# Altium project Compact Inverter H7 Logic Ver B.PrjPcb (part 2 of 2)

## Sheet MotorConnector.SchDoc
size A; SheetNumber: 8; SheetTotal: 11
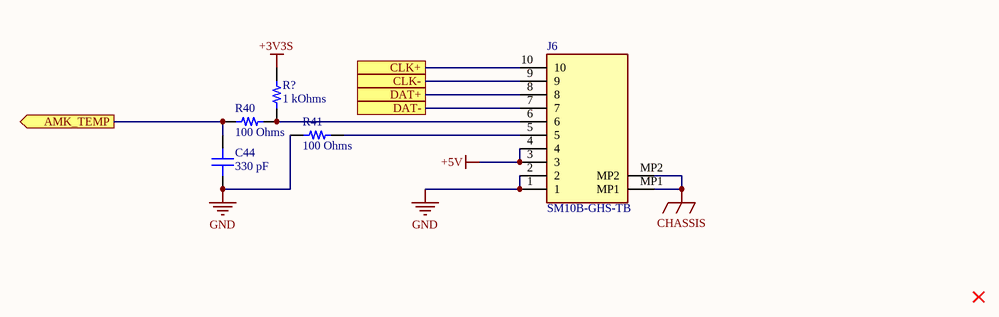
[diagram p6: MotorConnector.SchDoc]

### Parts
C44  330 pF  [CAP 0402_1005]
J6  SM10B-GHS-TB  [SM10BGHSTB]
R40  100 Ohms  [RES 0402_1005]
R41  100 Ohms  [RES 0402_1005]
R?  1 kOhms  [RES 0402_1005]

### Ports
AMK_TEMP (out), CLK+, CLK-, DAT+, DAT-

### Nets
+3V3S: R?.2  [project net 3V]
+5V: J6.3 J6.4
CHASSIS: J6.MP1 J6.MP2
GND: C44.1 J6.1 J6.2 R41.1
TEMP4: C44.2 R40.1 ; port AMK_TEMP
NetC1_2: J6.8 ; port DAT+
NetC3_1: J6.7 ; port DAT-
NetC4_2: J6.10 ; port CLK+
NetC6_1: J6.9 ; port CLK-
NetJ6_5: J6.5 R41.2
NetJ6_6: J6.6 R40.2 R?.1

### Library data of the parts
C44 = HMK105B7331MV-F: CAP CER 330PF 100V X7R 0402; manufacturer: Taiyo Yuden; Tolerance: ±20%; Part Number: HMK105B7331MV-F; Capacitance: 330 pF; Applications: SMPS Filtering; componentlink1description: Datasheet; componentlink1url: http://www.yuden.co.jp/productdata/catalog/mlcc06_e.pdf; componentlink2description: DigiKey Link; componentlink2url: https://www.digikey.com/en/products/detail/taiyo-yuden/HMK105B7331MV-F/6563581; Device Package: 0402 (1005 Metric); lastupdated: 2/9/2024 8:04:38 PM; Lifecycle Status: Active; Minimum Order: 1; Mounting Type: Surface Mount, MLCC; Operating Temperature: -55°C ~ 125°C; Package / Case: 0402 (1005 Metric); packaging: TapeAndReel; partid: 1855; Part Status: Active; price: 0.03; series: M; Size / Dimension: 0.039" L x 0.020" W (1.00mm x 0.50mm); Supplier 1: DigiKey; Supplier Part Number 1: 587-4988-1-ND; Temperature Coefficient: X7R; Thickness (Max): 0.022" (0.55mm); value: 330 pF; Voltage - Rated: 100V
J6 = SM10B-GHS-TB: Connector; Manufacturer_Name: 3D SYSTEMS; Datasheet Link: https://4donline.ihs.com/images/VipMasterIC/IC/JSTM/JSTMS02184/JSTMS02184-1.pdf?hkey=EF798316E3902B6ED9A73243A3159BB0; Height: 4.25mm; Manufacturer_Part_Number: SM10B-GHS-TB
R40 R41 = WR04X1000FTL: RES 100 OHM 1% 1/16W 0402; Manufacturer: Walsin Technology Corporation; Power (Watts): 0.063W, 1/16W; Temperature Coefficient: ±100ppm/°C; Part Number: WR04X1000FTL; Value: 100 Ohms; ComponentLink1Description: Datasheet; ComponentLink1URL: https://www.passivecomponent.com/wp-content/uploads/chipR/ASC_WR.pdf; ComponentLink2Description: DigiKey Link; ComponentLink2URL: https://www.digikey.com/en/products/detail/walsin-technology-corporation/WR04X1000FTL/13241075; Composition: Thick Film; Device Package: 0402 (1005 Metric); Height - Seated (Max): 0.016" (0.40mm); LastUpdated: 2/9/2024 8:28:55 PM; Lifecycle Status: Active; Minimum Order: 1; Number of Terminations: 2; Operating Temperature: -55°C ~ 155°C; Package / Case: 0402 (1005 Metric); Packaging: CutTape; PartId: 64787; Part Status: Active; Price: 0.01; Resistance: 100 Ohms; Series: WR; Size / Dimension: 0.039" L x 0.020" W (1.00mm x 0.50mm); Supplier 1: DigiKey; Supplier Part Number 1: 1292-WR04X1000FTLCT-ND; Supplier Device Package: 0402; Tolerance: ±1%
R? = WR04X1000FTL: RES 100 OHM 1% 1/16W 0402; Manufacturer: Walsin Technology Corporation; Power (Watts): 0.063W, 1/16W; Resistance: 100 Ohms; Temperature Coefficient: ±100ppm/°C; Part Number: WR04X1000FTL; Value: 1 kOhms; ComponentLink1Description: Datasheet; ComponentLink1URL: https://www.passivecomponent.com/wp-content/uploads/chipR/ASC_WR.pdf; ComponentLink2Description: DigiKey Link; ComponentLink2URL: https://www.digikey.com/en/products/detail/walsin-technology-corporation/WR04X1000FTL/13241075; Composition: Thick Film; Device Package: 0402 (1005 Metric); Height - Seated (Max): 0.016" (0.40mm); LastUpdated: 2/9/2024 8:28:55 PM; Lifecycle Status: Active; Minimum Order: 1; Number of Terminations: 2; Operating Temperature: -55°C ~ 155°C; Package / Case: 0402 (1005 Metric); Packaging: CutTape; PartId: 64787; Part Status: Active; Price: 0.01; Series: WR; Size / Dimension: 0.039" L x 0.020" W (1.00mm x 0.50mm); Supplier 1: DigiKey; Supplier Part Number 1: 1292-WR04X1000FTLCT-ND; Supplier Device Package: 0402; Tolerance: ±1%

## Sheet CANConnector.SchDoc
size A; SheetNumber: 9; SheetTotal: 11
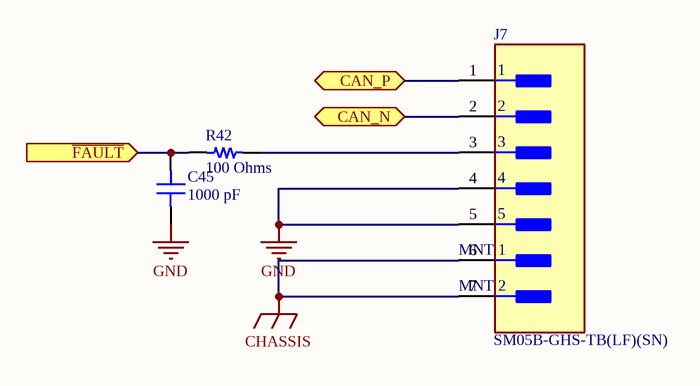
[diagram p7: CANConnector.SchDoc]

### Parts
C45  1000 pF  [CAP 0402_1005]
J7  SM05B-GHS-TB(LF)(SN)  [FP-SM05B-GHS-TB_LF_SN-MFG]
R42  100 Ohms  [RES 0402_1005]

### Ports
CAN_N (bidir), CAN_P (bidir), ~{FAULT} (in)

### Nets
CHASSIS: J7.6(MNT_1) J7.7(MNT_2)
GND: C45.1 J7.4 J7.5
CAN_N: J7.2 ; port CAN_N
CAN_P: J7.1 ; port CAN_P
~{FAULT}: C45.2 R42.1 ; port ~{FAULT}
NetJ7_3: J7.3 R42.2

### Library data of the parts
C45 = UMK105CG102JVHF: CAP CER 1000PF 50V C0G/NP0 0402; manufacturer: Taiyo Yuden; Temperature Coefficient: C0G, NP0; Tolerance: ±5%; Part Number: UMK105CG102JVHF; Capacitance: 1000 pF; Applications: Automotive; componentlink1description: Datasheet; componentlink1url: https://ds.yuden.co.jp/TYCOMPAS/ut/detail?pn=UMK105CG102JVHF &u=M; componentlink2description: DigiKey Link; componentlink2url: https://www.digikey.com/en/products/detail/taiyo-yuden/UMK105CG102JVHF/4811103; Device Package: 0402 (1005 Metric); lastupdated: 2/9/2024 8:04:38 PM; Lifecycle Status: Active; Minimum Order: 1; Mounting Type: Surface Mount, MLCC; Operating Temperature: -55°C ~ 125°C; Package / Case: 0402 (1005 Metric); packaging: TapeAndReel; partid: 1779; Part Status: Active; price: 0.01; Ratings: AEC-Q200; series: M; Size / Dimension: 0.039" L x 0.020" W (1.00mm x 0.50mm); Supplier 1: DigiKey; Supplier Part Number 1: 587-3737-1-ND; Thickness (Max): 0.022" (0.55mm); value: 1000 pF; Voltage - Rated: 50V
J7 = CMP-17439-000048-1: CONN HEADER SMD R/A 5POS 1.25MM; Current Rating: 1A; Pitch: 0.049inch; Connector Type: Outer Shroud Contact; Number of Positions: 5; Voltage Rating (AC): 50V; Wire/Cable Gauge: 26AWG; Series: GH; Mount: Surface Mount; Housing Material: Nylon; Contact Type: Outer Shroud Contact; REACH SVHC: No SVHC; Number of Rows: 1; Lead Free: Lead Free; Color: Natural; Contact Material: Bronze; Contact Plating: Tin; Max Operating Temperature: 85°C; Orientation: Right Angle; Number of Contacts: 5; Voltage Rating: 50V; Housing Color: Natural; Termination: Solder; Min Operating Temperature: -25°C; Fastening Type: Ramp; Packaging: Tape and Reel
R42 = WR04X1000FTL: as R40 on sheet MotorConnector; Part Number: WR04X1000FTL; Value: 100 Ohms; ComponentLink1Description: Datasheet; ComponentLink1URL: https://www.passivecomponent.com/wp-content/uploads/chipR/ASC_WR.pdf; ComponentLink2Description: DigiKey Link; ComponentLink2URL: https://www.digikey.com/en/products/detail/walsin-technology-corporation/WR04X1000FTL/13241075; Composition: Thick Film; Device Package: 0402 (1005 Metric); Height - Seated (Max): 0.016" (0.40mm); LastUpdated: 2/9/2024 8:28:55 PM; Lifecycle Status: Active; Minimum Order: 1; Number of Terminations: 2; Operating Temperature: -55°C ~ 155°C; Package / Case: 0402 (1005 Metric); Packaging: CutTape; PartId: 64787; Part Status: Active; Price: 0.01; Resistance: 100 Ohms; Series: WR; Size / Dimension: 0.039" L x 0.020" W (1.00mm x 0.50mm); Supplier 1: DigiKey; Supplier Part Number 1: 1292-WR04X1000FTLCT-ND; Supplier Device Package: 0402; Tolerance: ±1%

## Sheet Power.SchDoc
size A; SheetNumber: 3; SheetTotal: 11
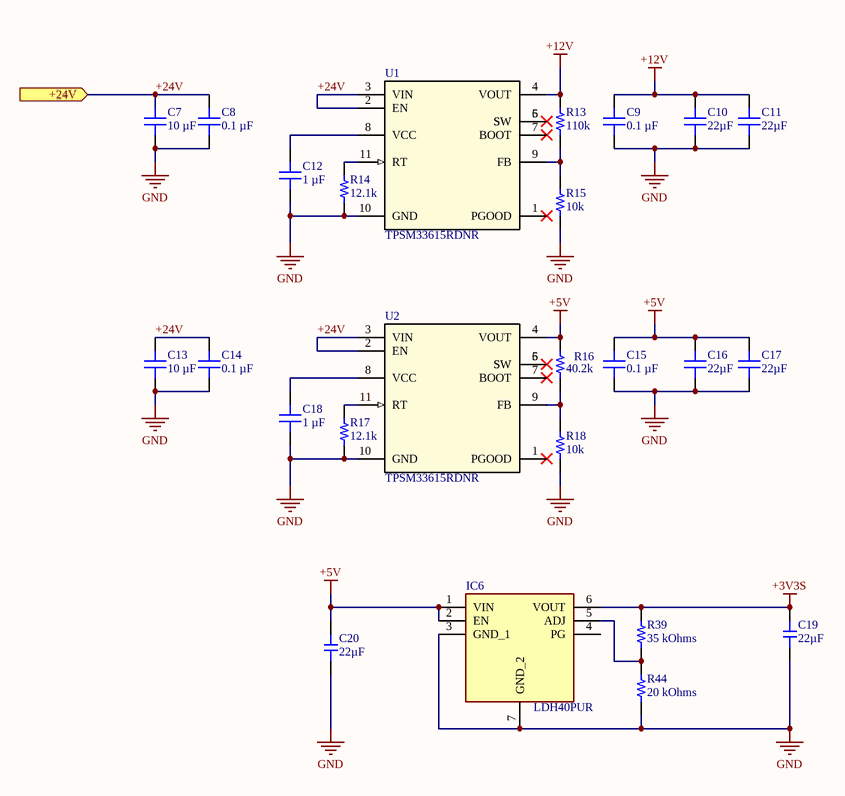
[diagram p8: Power.SchDoc]

### Parts
C7  10 µF  [CAP 1210_3225 - 1MM]
C8  0.1 µF  [CAP 0402_1005]
C9  0.1 µF  [CAP 0402_1005]
C10  22µF  [CAP 1210_3225 - 2.8MM]
C11  22µF  [CAP 1210_3225 - 2.8MM]
C12  1 µF  [CAP 0402_1005]
C13  10 µF  [CAP 1210_3225 - 1MM]
C14  0.1 µF  [CAP 0402_1005]
C15  0.1 µF  [CAP 0402_1005]
C16  22µF  [CAP 1210_3225 - 2.8MM]
C17  22µF  [CAP 1210_3225 - 2.8MM]
C18  1 µF  [CAP 0402_1005]
C19  value 22µF  [CAP-0603]  (hidden comment: CL10A226MQ8NRNC)
C20  value 22µF  [CAP-0603]  (hidden comment: CL10A226MQ8NRNC)
IC6  LDH40PUR  [SON65P200X200X80-7N]
R13  110k  [RES 0402_1005]
R14  12.1k  [RES 0402_1005]
R15  10k  [RES 0402_1005]
R16  40.2k  [RES 0402_1005]
R17  12.1k  [RES 0402_1005]
R18  10k  [RES 0402_1005]
R39  35 kOhms  [RES 0402_1005]
R44  20 kOhms  [RES 0402_1005]
U1  TPSM33615RDNR  [RDN0011A-MFG]
U2  TPSM33615RDNR  [RDN0011A-MFG]

### Ports
+24V (in)

### Nets
+3V3S: C19.2 IC6.6(VOUT) R39.1  [project net 3V]
+5V: C15.2 C16.2 C17.2 C20.2 IC6.1(VIN) IC6.2(EN) R16.1 U2.4(VOUT)
+12V: C9.2 C10.2 C11.2 R13.1 U1.4(VOUT)  [project net 12V]
GND: C7.1 C8.1 C9.1 C10.1 C11.1 C12.1 C13.1 C14.1 C15.1 C16.1 C17.1 C18.1 C19.1 C20.1 IC6.3(GND_1) IC6.7(GND_2) R14.2 R15.2 R17.2 R18.2 R44.2 U1.10(GND) U2.10(GND)
+24V: C7.2 C8.2 C13.2 C14.2 U1.2(EN) U1.3(VIN) U2.2(EN) U2.3(VIN) ; port +24V
NetC12_2: C12.2 U1.8(VCC)
NetC18_2: C18.2 U2.8(VCC)
NetIC6_5: IC6.5(ADJ) R39.2 R44.1
NetR13_2: R13.2 R15.1 U1.9(FB)
NetR14_1: R14.1 U1.11(RT)
NetR16_2: R16.2 R18.1 U2.9(FB)
NetR17_1: R17.1 U2.11(RT)
NetU1_5: U1.5(SW) U1.6(SW)
NetU2_5: U2.5(SW) U2.6(SW)

Not connected (* = marked no-connect by the designer): IC6 4(PG); U1 1(PGOOD)* 7(BOOT)*; U2 1(PGOOD)* 7(BOOT)*

### Library data of the parts
C7 C13 = GCJ32EC71H106KA01L: CAP CER 10UF 50V X7S 1210; manufacturer: Murata Electronics; Tolerance: ±10%; Part Number: GCJ32EC71H106KA01L; Value: 10 µF; Applications: Automotive, Boardflex Sensitive; Capacitance: 10 µF; componentlink1description: Datasheet; componentlink1url: https://search.murata.co.jp/Ceramy/image/img/A01X/G101/ENG/GCJ32EC71H106KA01-01.pdf; componentlink2description: DigiKey Link; componentlink2url: https://www.digikey.com/en/products/detail/murata-electronics/GCJ32EC71H106KA01L/6606047; Device Package: 1210 (3225 Metric); Features: Soft Termination; lastupdated: 6/4/2024 7:21:07 PM; Lifecycle Status: Active; Minimum Order: 1; Mounting Type: Surface Mount, MLCC; Operating Temperature: -55°C ~ 125°C; Package / Case: 1210 (3225 Metric); packaging: TapeAndReel; partid: 23622; Part Status: Active; price: 0.32; Ratings: AEC-Q200; series: GCJ; Size / Dimension: 0.126" L x 0.098" W (3.20mm x 2.50mm); Supplier 1: DigiKey; Supplier Part Number 1: 490-14418-1-ND; Temperature Coefficient: X7S; Thickness (Max): 0.110" (2.80mm); Voltage - Rated: 50V
C8 C9 C14 C15 = C0402C104K4RECAUTO: CAP CER 0402 0.1UF 16V X7R 10%; manufacturer: KEMET; Part Number: C0402C104K4RECAUTO; Capacitance: 0.1 µF; Applications: Automotive, ESD Protection; componentlink1description: Datasheet; componentlink1url: https://api.kemet.com/component-edge/download/datasheet/C0402C104K4RECAUTO.pdf; componentlink2description: DigiKey Link; componentlink2url: https://www.digikey.com/en/products/detail/kemet/C0402C104K4RECAUTO/8563695; Device Package: 0402 (1005 Metric); lastupdated: 2/9/2024 8:04:38 PM; Lifecycle Status: Active; Minimum Order: 1; Mounting Type: Surface Mount, MLCC; Operating Temperature: -55°C ~ 125°C; Package / Case: 0402 (1005 Metric); packaging: TapeAndReel; partid: 1731; Part Status: Active; price: 0.01; Ratings: AEC-Q200; series: ESD SMD Auto X7R; Size / Dimension: 0.039" L x 0.020" W (1.00mm x 0.50mm); Supplier 1: DigiKey; Supplier Part Number 1: 399-17167-1-ND; Temperature Coefficient: X7R; Thickness (Max): 0.022" (0.55mm); Tolerance: ±10%; value: 0.1 µF; Voltage - Rated: 16V
C10 C11 C16 C17 = 12103D226MAT2A: CAP CER 22UF 25V X5R 1210; manufacturer: AVX Corporation; Tolerance: ±20%; Part Number: 12103D226MAT2A; Value: 22µF; Applications: General Purpose; Capacitance: 22µF; componentlink1description: Datasheet; componentlink1url: http://datasheets.avx.com/cx5r.pdf; componentlink2description: DigiKey Link; componentlink2url: http://digikey.com/product-detail/en/avx-corporation/12103D226MAT2A/478-5045-1-ND/1888256; Device Package: 1210 (3225 Metric); lastupdated: 9/2/2020 1:10:51 AM; Lifecycle Status: Active; Minimum Order: 1; Mounting Type: Surface Mount, MLCC; Operating Temperature: -55°C ~ 85°C; Package / Case: 1210 (3225 Metric); packaging: TapeAndReel; partid: 23827; Part Status: Active; price: 0.32; series: -; Size / Dimension: 0.126" L x 0.098" W (3.20mm x 2.50mm); Supplier 1: DigiKey; Supplier Part Number 1: 478-5045-1-ND; Temperature Coefficient: X5R; Thickness (Max): 0.110" (2.79mm); Voltage - Rated: 25V
C12 C18 = CL05A105KO5NNNC: CAP CER 1UF 16V X5R 0402; Part Number: C29266; manufacturer: Samsung Electro-Mechanics; Tolerance: ±10%; Capacitance: 1 µF; Applications: General Purpose; componentlink1description: Datasheet; componentlink1url: http://www.samsungsem.com/kr/support/product-search/mlcc/CL05A105KO5NNNC.jsp; componentlink2description: DigiKey Link; componentlink2url: https://www.digikey.com/en/products/detail/samsung-electro-mechanics/CL05A105KO5NNNC/3886725; Device Package: 0402 (1005 Metric); lastupdated: 2/9/2024 8:04:35 PM; Lifecycle Status: Active; Minimum Order: 1; Mounting Type: Surface Mount, MLCC; Operating Temperature: -55°C ~ 85°C; Package / Case: 0402 (1005 Metric); packaging: TapeAndReel; partid: 3120; Part Status: Active; price: 0.01; series: CL; Size / Dimension: 0.039" L x 0.020" W (1.00mm x 0.50mm); Supplier 1: DigiKey; Supplier Part Number 1: 1276-1067-1-ND; Temperature Coefficient: X5R; Thickness (Max): 0.022" (0.55mm); value: 1 µF; Voltage - Rated: 16V
C19 C20 = CMP-001-00651-2: Capacitor, Ceramic (MLCC), 22uF, ±20%, 6.3V, X5R, ±20%, SMD 0603; Manufacturer: Samsung Electro-Mechanics; Impedance (0V Bias) @ 10kHz: 1.09Ω; Capacitance @ 1V DC Bias: 17.820uF; Capacitance @ 3.3V DC Bias: 8.834uF; Impedance (0V Bias) @ 500MHz: 0.428Ω; Impedance (0V Bias) @ 1kHz: 10.5Ω; Impedance (0V Bias) @ 500kHz: 0.0212Ω; Capacitance @ 1.8V DC Bias: 14.074uF; Impedance (0V Bias) @ 1MHz: 0.00751Ω; Impedance (0V Bias) @ 5kHz: 2.16Ω; Capacitance @ 1.5V DC Bias: 15.472uF; Impedance (0V Bias) @ 100MHz: 0.12Ω; Impedance (0V Bias) @ 100Hz: 100Ω; Impedance (0V Bias) @ 50kHz: 0.224Ω; Impedance (0V Bias) @ 5MHz: 0.0137Ω; Capacitance @ 5V DC Bias: 5.741uF; Impedance (0V Bias) @ 500Hz: 20.7Ω; Impedance (0V Bias) @ 5GHz: 3.43Ω; Capacitance @ 1.35V DC Bias: 16.197uF; Impedance (0V Bias) @ 10MHz: 0.0217Ω; Impedance (0V Bias) @ 2GHz: 1.72Ω; Capacitance @ 2.5V DC Bias: 11.369uF; Impedance (0V Bias) @ 50MHz: 0.0716Ω; Capacitance @ 1.2V DC Bias: 16.916uF; Impedance (0V Bias) @ 100kHz: 0.113Ω; Capacitance @ 4.2V DC Bias: 6.952uF; Capacitance @ 3.7V DC Bias: 7.897uF; Impedance (0V Bias) @ 1GHz: 0.751Ω; Temperature Rating: -55°C ~ 85°C; JLCPCB Basic Part: Yes; Temperature Coefficient: X5R; Tolerance: 20%; ComponentLink2Description: JLCPCB Part URL; ComponentLink1URL: https://wmsc.lcsc.com/wmsc/upload/file/pdf/v2/lcsc/2304140030_Samsung-Electro-Mechanics-CL10A226MQ8NRNC_C59461.pdf; ComponentLink4Description: Samsung Component Library; RoHS: Yes; Voltage Rating: 6.3V; ComponentLink4URL: https://weblib.samsungsem.com/mlcc/mlcc-ec.do?partNumber=CL10A226MQ8NRN; ComponentLink3Description: LCSC Part URL; ComponentLink2URL: https://jlcpcb.com/partdetail/C59461; Case/Package: 0603; Manufacturer Part Number: CL10A226MQ8NRNC; ComponentLink1Description: Datasheet; JLCPCB Part Number: C59461; ComponentLink3URL: https://lcsc.com/product-detail/Multilayer-Ceramic-Capacitors-MLCC---SMD-SMT_Samsung-Electro-Mechanics-Samsung-Electro-Mechanics-CL10A226MQ8NRNC_C59461.html; Design Item ID: CL10A226MQ8NRNC; Category: Capacitors - MLCC; Source: jlcpcb_2025_04_capacitors_basic.schlib
IC6 = LDH40PUR: Integrated Circuit; Manufacturer_Name: STMicroelectronics; Datasheet Link: https://www.st.com/resource/en/datasheet/ldh40.pdf; Height: 0.8mm; Manufacturer_Part_Number: LDH40PUR
R13 R16 = RQ73C1E10K5BTD: RES 10.5 KOHMS 0.1% 1/16W 0402; Part Number: C166559; Manufacturer: TE Connectivity Passive Product; Power (Watts): 0.063W, 1/16W; Resistance: 50k; Temperature Coefficient: ±10ppm/°C; ComponentLink1Description: Datasheet; ComponentLink1URL: //media.digikey.com/pdf/Data%20Sheets/Tyco%20Electronics%20P%20B%20PDFs/RQ73-0618%20v2.pdf; ComponentLink2Description: DigiKey Link; ComponentLink2URL: https://www.digikey.com/en/products/detail/te-connectivity-passive-product/RQ73C1E10K5BTD/9479898; Composition: Thin Film; Device Package: 0402 (1005 Metric); Features: Anti-Sulfur, Automotive AEC-Q200; Height - Seated (Max): 0.016" (0.40mm); LastUpdated: 2/9/2024 8:30:17 PM; Lifecycle Status: Active; Minimum Order: 1; Number of Terminations: 2; Operating Temperature: -55°C ~ 155°C; Package / Case: 0402 (1005 Metric); Packaging: TapeAndReel; PartId: 4287; Part Status: Active; Price: 0.27; Ratings: AEC-Q200; Series: RQ73; Size / Dimension: 0.039" L x 0.020" W (1.00mm x 0.50mm); Supplier 1: DigiKey; Supplier Part Number 1: A139950CT-ND; Supplier Device Package: 0402; Tolerance: ±0.1%
  R13: Value: 110k
  R16: Value: 40.2k
R14 R17 = RQ73C1E10K5BTD: RES 10.5 KOHMS 0.1% 1/16W 0402; Part Number: C132157; Manufacturer: TE Connectivity Passive Product; Power (Watts): 0.063W, 1/16W; Temperature Coefficient: ±10ppm/°C; Value: 12.1k; ComponentLink1Description: Datasheet; ComponentLink1URL: //media.digikey.com/pdf/Data%20Sheets/Tyco%20Electronics%20P%20B%20PDFs/RQ73-0618%20v2.pdf; ComponentLink2Description: DigiKey Link; ComponentLink2URL: https://www.digikey.com/en/products/detail/te-connectivity-passive-product/RQ73C1E10K5BTD/9479898; Composition: Thin Film; Device Package: 0402 (1005 Metric); Features: Anti-Sulfur, Automotive AEC-Q200; Height - Seated (Max): 0.016" (0.40mm); LastUpdated: 2/9/2024 8:30:17 PM; Lifecycle Status: Active; Minimum Order: 1; Number of Terminations: 2; Operating Temperature: -55°C ~ 155°C; Package / Case: 0402 (1005 Metric); Packaging: TapeAndReel; PartId: 4287; Part Status: Active; Price: 0.27; Ratings: AEC-Q200; Resistance: 12.1k; Series: RQ73; Size / Dimension: 0.039" L x 0.020" W (1.00mm x 0.50mm); Supplier 1: DigiKey; Supplier Part Number 1: A139950CT-ND; Supplier Device Package: 0402; Tolerance: ±0.1%
R15 R18 = RQ73C1E10K5BTD: RES 10.5 KOHMS 0.1% 1/16W 0402; Part Number: C25744; Manufacturer: TE Connectivity Passive Product; Power (Watts): 0.063W, 1/16W; Temperature Coefficient: ±10ppm/°C; Value: 10k; ComponentLink1Description: Datasheet; ComponentLink1URL: //media.digikey.com/pdf/Data%20Sheets/Tyco%20Electronics%20P%20B%20PDFs/RQ73-0618%20v2.pdf; ComponentLink2Description: DigiKey Link; ComponentLink2URL: https://www.digikey.com/en/products/detail/te-connectivity-passive-product/RQ73C1E10K5BTD/9479898; Composition: Thin Film; Device Package: 0402 (1005 Metric); Features: Anti-Sulfur, Automotive AEC-Q200; Height - Seated (Max): 0.016" (0.40mm); LastUpdated: 2/9/2024 8:30:17 PM; Lifecycle Status: Active; Minimum Order: 1; Number of Terminations: 2; Operating Temperature: -55°C ~ 155°C; Package / Case: 0402 (1005 Metric); Packaging: TapeAndReel; PartId: 4287; Part Status: Active; Price: 0.27; Ratings: AEC-Q200; Resistance: 10k; Series: RQ73; Size / Dimension: 0.039" L x 0.020" W (1.00mm x 0.50mm); Supplier 1: DigiKey; Supplier Part Number 1: A139950CT-ND; Supplier Device Package: 0402; Tolerance: ±0.1%
R39 R44 = WR04X102 JTL: RES 1K OHM 5% 1/16W 0402; Manufacturer: Walsin Technology Corporation; Power (Watts): 0.063W, 1/16W; Resistance: 1 kOhms; Temperature Coefficient: ±100ppm/°C; Part Number: WR04X102 JTL; ComponentLink1Description: Datasheet; ComponentLink1URL: https://www.passivecomponent.com/wp-content/uploads/chipR/ASC_WR.pdf; ComponentLink2Description: DigiKey Link; ComponentLink2URL: https://www.digikey.com/en/products/detail/walsin-technology-corporation/WR04X102-JTL/13238927; Composition: Thick Film; Device Package: 0402 (1005 Metric); Height - Seated (Max): 0.016" (0.40mm); LastUpdated: 2/9/2024 8:28:50 PM; Lifecycle Status: Active; Minimum Order: 1; Number of Terminations: 2; Operating Temperature: -55°C ~ 155°C; Package / Case: 0402 (1005 Metric); Packaging: CutTape; PartId: 68140; Part Status: Active; Price: 0.01; Series: WR; Size / Dimension: 0.039" L x 0.020" W (1.00mm x 0.50mm); Supplier 1: DigiKey; Supplier Part Number 1: 1292-WR04X102JTLCT-ND; Supplier Device Package: 0402; Tolerance: ±5%
  R39: Value: 35 kOhms
  R44: Value: 20 kOhms
U1 U2 = TPSM33615RDNR: No Description Available; Mfr_Name: Texas Instruments; TYPE: TYPE; RefDes: RefDes

## Sheet PowerConnector.SchDoc
size A; SheetNumber: 11; SheetTotal: 11
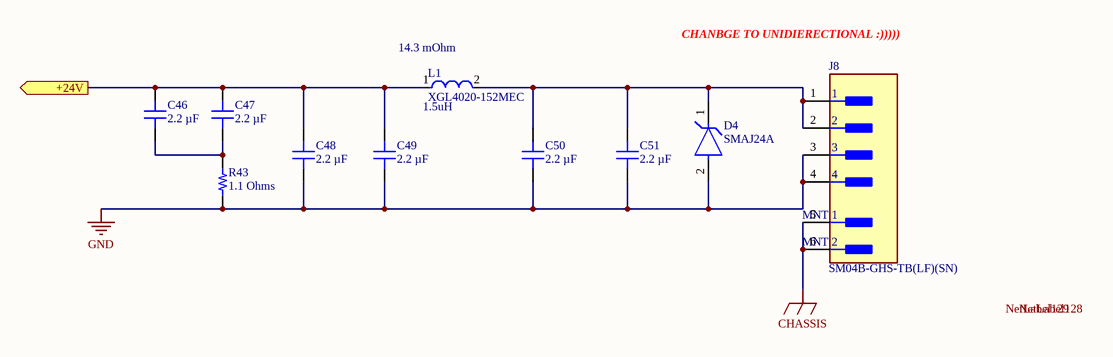
[diagram p9: PowerConnector.SchDoc]

### Parts
C46  2.2 µF  [CAP 0805_2012]
C47  2.2 µF  [CAP 0805_2012]
C48  2.2 µF  [CAP 0805_2012]
C49  2.2 µF  [CAP 0805_2012]
C50  2.2 µF  [CAP 0805_2012]
C51  2.2 µF  [CAP 0805_2012]
D4  SMAJ24A  [FP-SMAJ-MFG]
J8  SM04B-GHS-TB(LF)(SN)  [FP-SM04B-GHS-TB_LF_SN-MFG]
L1  XGL4020-152MEC  value 1.5uH  [FP-XGL4020-MFG]
R43  1.1 Ohms  [RES 0603_1608]

### Ports
+24V (out)

### Nets
CHASSIS: J8.5(MNT_1) J8.6(MNT_2)
GND: C48.1 C49.1 C50.1 C51.1 D4.2(A) J8.3 J8.4 R43.1
+24V: C46.2 C47.2 C48.2 C49.2 L1.1 ; port +24V
NetC46_1: C46.1 C47.1 R43.2
NetC50_2: C50.2 C51.2 D4.1(C) J8.1 J8.2 L1.2

### Notes on the sheet
- (near L1) 14.3 mOhm
- CHANBGE TO UNIDIERECTIONAL :)))))
- Labels drawn without touching a wire or pin: NetLabel128, NetLabel129

### Library data of the parts
C46-C51 = CGA4J3X5R1H225K125AB: CAP CER 2.2UF 50V X5R 0805; manufacturer: TDK Corporation; Tolerance: ±10%; Part Number: CGA4J3X5R1H225K125AB; Capacitance: 2.2 µF; Applications: Automotive; componentlink1description: Datasheet; componentlink1url: https://product.tdk.com/info/en/catalog/datasheets/mlcc_automotive_general_en.pdf?ref_disty=digikey; componentlink2description: DigiKey Link; componentlink2url: https://www.digikey.com/en/products/detail/tdk-corporation/CGA4J3X5R1H225K125AB/2781306; Device Package: 0805 (2012 Metric); lastupdated: 2/9/2024 8:15:32 PM; Lifecycle Status: Active; Minimum Order: 1; Mounting Type: Surface Mount, MLCC; Operating Temperature: -55°C ~ 85°C; Package / Case: 0805 (2012 Metric); packaging: TapeAndReel; partid: 44302; Part Status: Active; price: 0.11; Ratings: AEC-Q200; series: CGA; Size / Dimension: 0.079" L x 0.049" W (2.00mm x 1.25mm); Supplier 1: DigiKey; Supplier Part Number 1: 445-7880-1-ND; Temperature Coefficient: X5R; Thickness (Max): 0.057" (1.45mm); value: 2.2 µF; Voltage - Rated: 50V
D4 = CMP-08607-000085-1: TVS DIODE 24V 38.9V DO214AC; Manufacturer: Littelfuse Inc; Direction: Unidirectional; Peak Pulse Power: 400W; Peak Pulse Current: 10.3A; Max Junction Temp: +150°C; Breakdown Voltage: 26.7V; Number Of Channels: 1; ComponentLink2Description: Datasheet; Device Class L3: unset; Height: 2.29mm; ComponentLink2URL: https://www.littelfuse.com/~/media/electronics/datasheets/tvs_diodes/littelfuse_tvs_diode_smaj_datasheet.pdf.pdf; Device Class L1: Circuit Protection; Package: SMAJ; Temperature Range High: +150°C; Device Class L2: TVS Diodes; Clamping Voltage: 38.9V; Reverse Standoff Voltage: 24V; Manufacturer Part Number: SMAJ24A; Mouser Description: In a Pack of 25, Littelfuse SMAJ24A, Uni-Directional TVS Diode, 400W, 2-Pin DO-214AC; Digikey Description: TVS DIODE 24V 38.9V DO214AC; Lead Free: Yes; Octopart: https://octopart.com/smaj24a-littelfuse-350003; Automotive: No; Temperature Range Low: -65°C; Category: Diode; RoHS: TRUE; Temperature: -65°C to +150°C
J8 = CMP-17439-000411-1: CONN HEADER SMD R/A 4POS 1.25MM; Voltage Rating: 50V; Number of Contacts: 4; Current Rating: 1A; Termination: Solder; Mount: Surface Mount; REACH SVHC: No SVHC; Packaging: Cut Tape; Contact Material: Bronze; Series: GH; Orientation: Right Angle; Lead Free: Lead Free; Housing Material: Nylon; Contact Plating: Tin; Housing Color: Natural; Number of Rows: 1; Pitch: 1.25mm; Number of Positions: 4
L1 = CMP-11268-000020-1: Shielded Power Inductors; Manufacturer: Coilcraft; Saturation Current: 3.2A; Rms Current: 11.1A; Standoff Height: 0.12mm; Self Resonant Frequency: 45MHz; Series Resistance: 14.3mΩ; Test Frequency: 1MHz; Automotive Grade: Grade 1; Tolerance: 20%; Shielding: true; Core Material: Wirewound; ComponentLink2Description: Datasheet; Device Class L3: Fixed Inductors; Category: Ind; Device Class L2: Inductors; Inductance: 1.5uH; Package: XGL4020; Automotive: Yes; Ambient Temperature Range Low: -40°C; Manufacturer Part Number: XGL4020-152MEC; ComponentLink2URL: https://www.coilcraft.com/pdfs/xgl4020.pdf; Lead Free: Yes; RoHS: TRUE; Height: 2.1mm; Device Class L1: Passive Components; Composition: Composite; Ambient Temperature Range High: +125°C; Octopart: https://octopart.com/xgl4020-152mec-coilcraft-99681026
R43 = SR731JRTTD1R10F: RES 1.1 OHM 1% 1/5W 0603; Manufacturer: KOA Speer Electronics, Inc.; Power (Watts): 0.2W, 1/5W; Temperature Coefficient: ±200ppm/°C; Part Number: SR731JRTTD1R10F; Value: 1.1 Ohms; ComponentLink1Description: Datasheet; ComponentLink1URL: https://www.koaspeer.com/pdfs/SR73-RT.pdf; ComponentLink2Description: DigiKey Link; ComponentLink2URL: https://www.digikey.com/en/products/detail/koa-speer-electronics-inc/SR731JRTTD1R10F/13426422; Composition: Thick Film; Device Package: 0603 (1608 Metric); Features: Anti-Sulfur, Automotive AEC-Q200, Current Sense, Moisture Resistant; Height - Seated (Max): 0.022" (0.55mm); LastUpdated: 2/9/2024 8:41:12 PM; Lifecycle Status: Active; Minimum Order: 1; Number of Terminations: 2; Operating Temperature: -55°C ~ 155°C; Package / Case: 0603 (1608 Metric); Packaging: TapeAndReel; PartId: 67152; Part Status: Active; Price: 0.09; Ratings: AEC-Q200; Resistance: 1.1 Ohms; Series: SR73-RT; Size / Dimension: 0.063" L x 0.031" W (1.60mm x 0.80mm); Supplier 1: DigiKey; Supplier Part Number 1: 2019-SR731JRTTD1R10FCT-ND; Supplier Device Package: 0603; Tolerance: ±1%

## Sheet SDMMC.SchDoc
size A; SheetNumber: 11; SheetTotal: 11
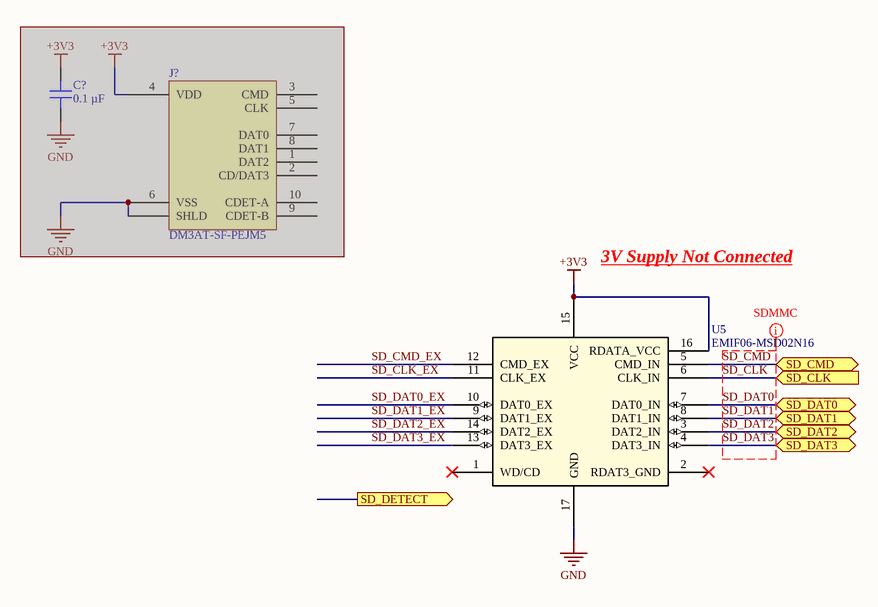
[diagram p10: SDMMC.SchDoc]

### Parts
C?  0.1 µF  [CAP 0402_1005]  (masked out: inside a compile mask, not in the netlist)
J?  DM3AT-SF-PEJM5  [HIROSE DM3AT-SF-PEJM5]  (masked out: inside a compile mask, not in the netlist)
U5  EMIF06-MSD02N16  [EMIF06MSD02N16]

### Ports
SD_CLK (in), SD_CMD (bidir), SD_DAT0 (bidir), SD_DAT1 (bidir), SD_DAT2 (bidir), SD_DAT3 (bidir), SD_DETECT (out)

### Nets
+3V3: U5.15(VCC) U5.16(RDATA_VCC)
GND: U5.17(GND)
SD_CLK: U5.6(CLK_IN) ; port SD_CLK
SD_CLK_EX: U5.11(CLK_EX)
SD_CMD: U5.5(CMD_IN) ; port SD_CMD
SD_CMD_EX: U5.12(CMD_EX)
SD_DAT0: U5.7(DAT0_IN) ; port SD_DAT0
SD_DAT0_EX: U5.10(DAT0_EX)
SD_DAT1: U5.8(DAT1_IN) ; port SD_DAT1
SD_DAT1_EX: U5.9(DAT1_EX)
SD_DAT2: U5.3(DAT2_IN) ; port SD_DAT2
SD_DAT2_EX: U5.14(DAT2_EX)
SD_DAT3: U5.4(DAT3_IN) ; port SD_DAT3
SD_DAT3_EX: U5.13(DAT3_EX)

Not connected (* = marked no-connect by the designer): U5 1(WD/CD)* 2(RDAT3_GND)*

### Layout directives
net class SDMMC: SD_CLK, SD_CMD, SD_DAT0, SD_DAT1, SD_DAT2, SD_DAT3

### Notes on the sheet
- 3V Supply Not Connected

### Library data of the parts
C? = C0402C104K4RECAUTO: as C8 on sheet Power; Part Number: C0402C104K4RECAUTO; Capacitance: 0.1 µF; Applications: Automotive, ESD Protection; componentlink1description: Datasheet; componentlink1url: https://api.kemet.com/component-edge/download/datasheet/C0402C104K4RECAUTO.pdf; componentlink2description: DigiKey Link; componentlink2url: https://www.digikey.com/en/products/detail/kemet/C0402C104K4RECAUTO/8563695; Device Package: 0402 (1005 Metric); lastupdated: 2/9/2024 8:04:38 PM; Lifecycle Status: Active; Minimum Order: 1; Mounting Type: Surface Mount, MLCC; Operating Temperature: -55°C ~ 125°C; Package / Case: 0402 (1005 Metric); packaging: TapeAndReel; partid: 1731; Part Status: Active; price: 0.01; Ratings: AEC-Q200; series: ESD SMD Auto X7R; Size / Dimension: 0.039" L x 0.020" W (1.00mm x 0.50mm); Supplier 1: DigiKey; Supplier Part Number 1: 399-17167-1-ND; Temperature Coefficient: X7R; Thickness (Max): 0.022" (0.55mm); Tolerance: ±10%; value: 0.1 µF; Voltage - Rated: 16V
J? = DM3AT-SF-PEJM5: CONN MICRO SD CARD PUSH-PUSH R/A; Manufacturer: Hirose Electric Co Ltd; Card Type: Secure Digital - microSD™; Connector Type: Connector and Ejector; Insertion, Removal Method: Push In, Push Out; Number of Positions: 10 (8 + 2); Part Number: DM3AT-SF-PEJM5; ComponentLink1Description: Datasheet; ComponentLink1URL: https://www.hirose.com/product/document?clcode=CL0609-0033-6-00&productname=DM3AT-SF-PEJ2M5&series=DM3&documenttype=Catalog&lang=en&documentid=D49662_en; ComponentLink2Description: DigiKey Link; ComponentLink2URL: //digikey.com/product-detail/en/hirose-electric-co-ltd/DM3AT-SF-PEJM5/HR1964TR-ND/2533565; Contact Finish: Gold; Features: Switch; Height Above Board: 0.066" (1.68mm); LastUpdated: 12/16/2019 8:34:40 PM; Lifecycle Status: 0; Minimum Order: 1; Mounting Feature: Normal, Standard - Top; Mounting Type: Surface Mount, Right Angle; Packaging: TapeAndReel; Part Status: Active; Price: 1.41; Series: DM3; Supplier 1: DigiKey; Supplier Part Number 1: HR1964TR-ND
U5 = EMIF06-MSD02N16: No Description Available; Mfr_Name: STMicroelectronics; RefDes: RefDes; Type: Type

## Nets that join several sheets
3V: MCU (18 pins), Connector (5 pins), EnDat (9 pins), CANBus (C38.2 IC5.5), PeripheralConnector (J4.3 J5.1 R27.2 R28.2), MotorConnector (R?.2), Power (C19.2 IC6.6 R39.1)
12V: Connector (D5.1 J1.14 J1.16), Power (5 pins)
+5V: MCU (C36.2 FB1.1), CANBus (C39.2 IC5.3), MotorConnector (J6.3 J6.4), Power (8 pins)
CHASSIS: Top (12 pins), Connector (J1.S1 J1.S2), PeripheralConnector (J4.5 J4.6 J5.4 J5.5), MotorConnector (J6.MP1 J6.MP2), CANConnector (J7.6 J7.7), PowerConnector (J8.5 J8.6)
GND: Top (JP1.2 JP2.2 JP3.2 JP4.2), MCU (43 pins), Connector (12 pins), EnDat (10 pins), CANBus (6 pins), PeripheralConnector (C40.1 J4.4 J5.3), MotorConnector (C44.1 J6.1 J6.2 R41.1), CANConnector (C45.1 J7.4 J7.5), Power (23 pins), PowerConnector (8 pins), SDMMC (U5.17)
+24V: Power (8 pins), PowerConnector (5 pins)
ADC0: MCU (U4.28), PeripheralConnector (C40.2 R29.1)
CAN_N: CANBus (XMER1.3), CANConnector (J7.2)
CAN_P: CANBus (XMER1.2), CANConnector (J7.1)
DAT: MCU (FL5.3), Connector (J1.21 J1.22 U3.3)
ENC_CLB_CLK: MCU (U4.29), EnDat (IC2.4 R11.1)
ENC_DAT_EN: MCU (U4.36), EnDat (IC1.2 IC1.3 R4.2)
ENC_SPI_MISO: MCU (U4.30), EnDat (IC1.1 R2.1)
ENC_SPI_MOSI: MCU (U4.31), EnDat (IC1.4 R5.2)
~{FAULT}: MCU (U4.98), CANConnector (C45.2 R42.1)
FDCAN1_RX: MCU (U4.95), CANBus (IC5.4)
FDCAN1_TX: MCU (U4.96), CANBus (IC5.1)
HALL_SPI_CLK_S: MCU (FL3.3), Connector (J1.19 J1.20 U3.1)
I2C1_SCK: MCU (U4.92), PeripheralConnector (J4.1 R27.1)
I2C1_SDA: MCU (U4.93), PeripheralConnector (J4.2 R28.1)
IU+: MCU (U4.22), Connector (R24.1)
IU-: MCU (U4.23), Connector (R31.1)
IV+: MCU (U4.32), Connector (R30.2)
IV-: MCU (U4.33), Connector (R23.2)
IW+: MCU (U4.34), Connector (R33.2)
IW-: MCU (U4.35), Connector (R32.2)
NetC1_2: EnDat (C1.2 R1.2 R3.2), MotorConnector (J6.8)
NetC3_1: EnDat (C3.1 R3.1 R6.2), MotorConnector (J6.7)
NetC4_2: EnDat (C4.2 R7.2 R36.2), MotorConnector (J6.10)
NetC6_1: EnDat (C6.1 R12.2 R36.1), MotorConnector (J6.9)
OE: MCU (U4.44), Connector (J1.07 J1.34 J1.35 U3.6)
~{PG}_S: MCU (FL1.3), Connector (J1.18)
TEMP1: MCU (U4.24), Connector (J1.13 U6.5)
TEMP2: MCU (U4.25), Connector (J1.27 U7.5)
TEMP3: MCU (U4.17), Connector (J1.28 U8.5)
TEMP4: MCU (U4.18), MotorConnector (C44.2 R40.1)
U_A_IN: MCU (U4.39), Connector (J1.11 U6.1)
U_B_IN: MCU (U4.38), Connector (J1.09 U6.3)
U_OC: MCU (U4.55), Connector (J1.03)
V_A_IN: MCU (U4.41), Connector (J1.39 U7.3)
V_B_IN: MCU (U4.40), Connector (J1.37 U7.1)
V_OC: MCU (U4.56), Connector (J1.31)
V_SENSE_N: MCU (U4.16), Connector (R35.1)
V_SENSE_P: MCU (U4.15), Connector (R34.1)
W_A_IN: MCU (U4.43), Connector (J1.30 U8.6)
W_B_IN: MCU (U4.42), Connector (J1.32 U8.4)
W_OC: MCU (U4.57), Connector (J1.38)